# EAGLE design eib-32-intan-hs (EAGLE 8.3.2)
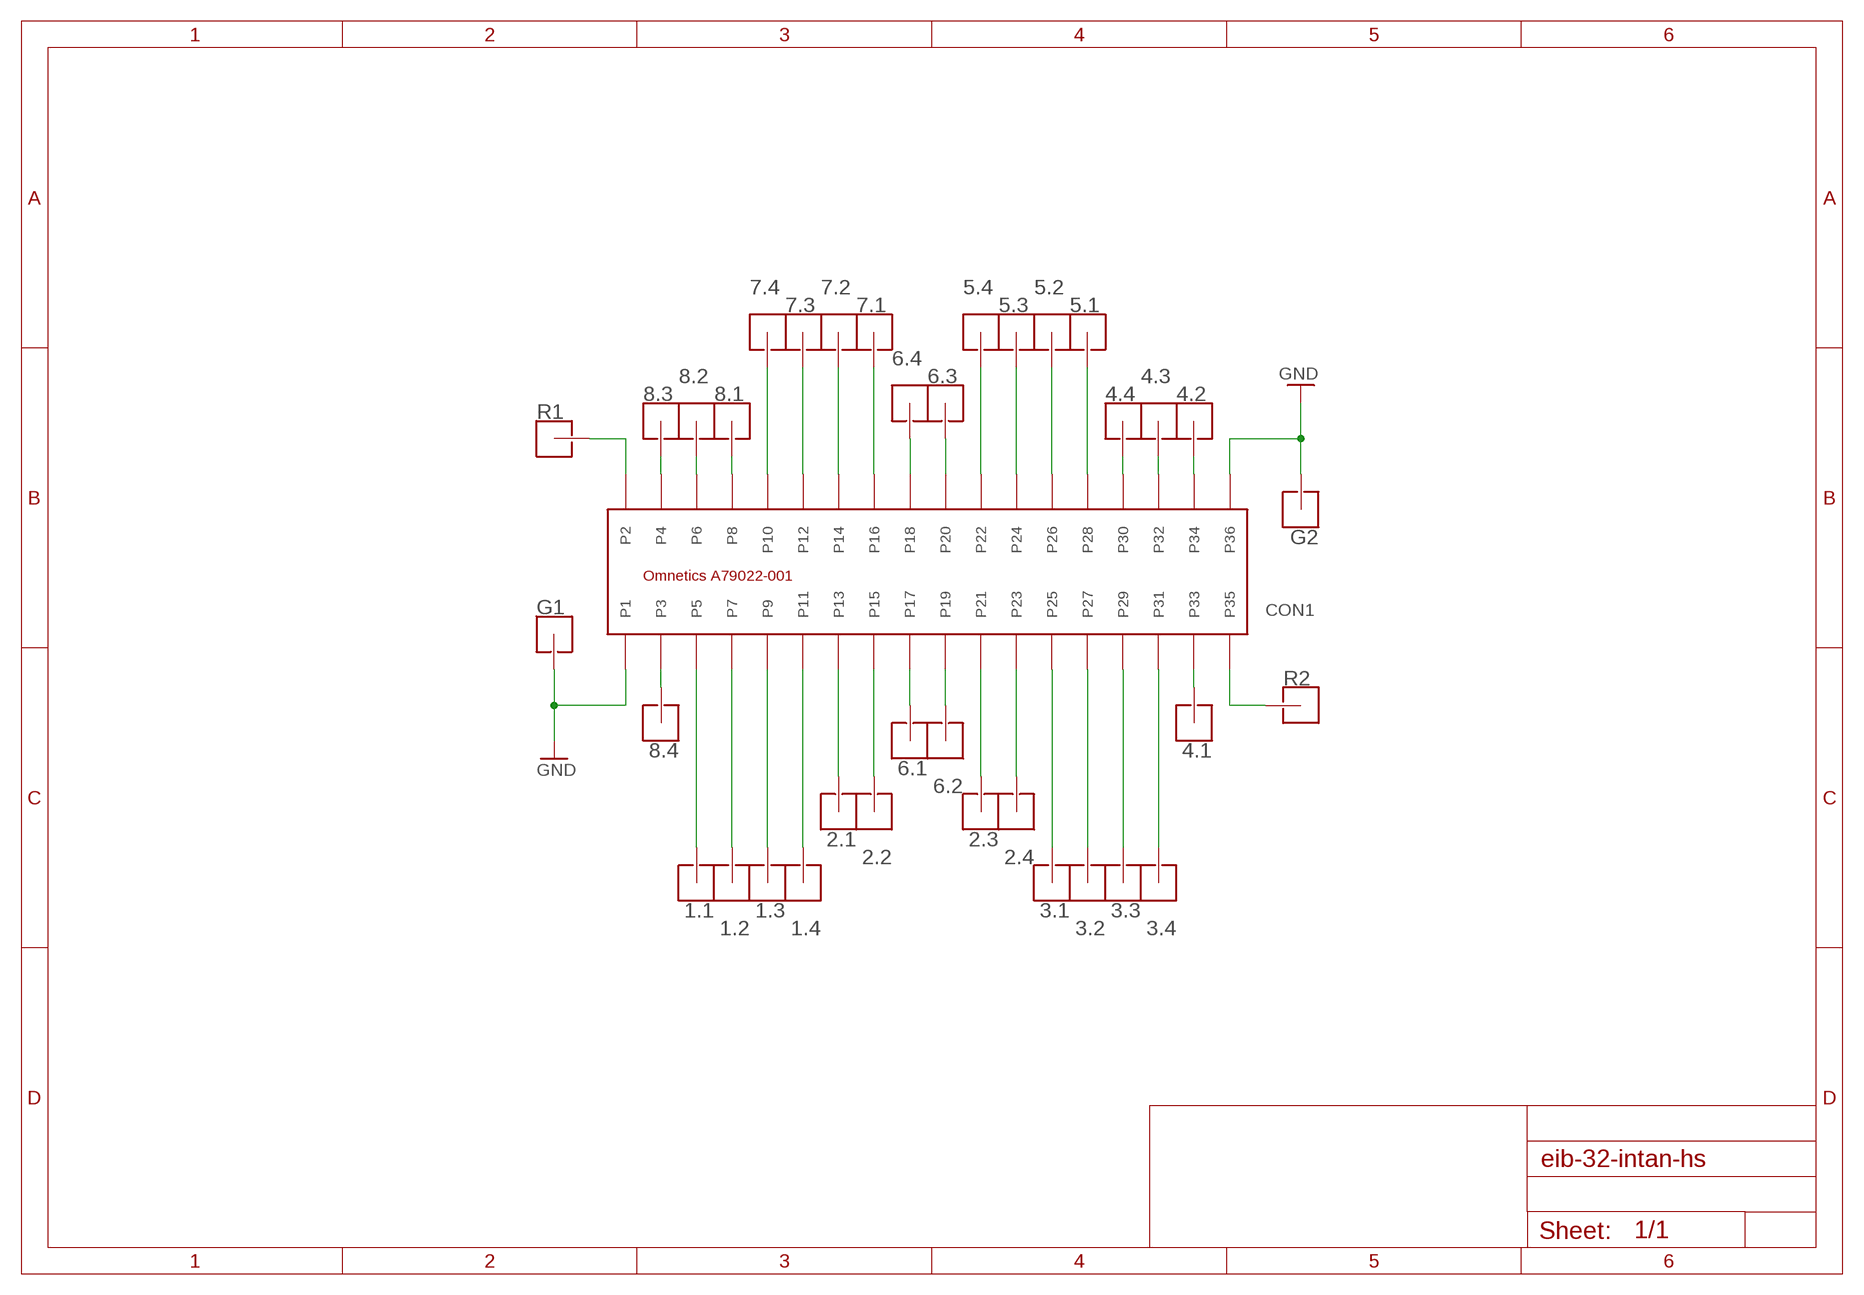
[diagram p0: schematic, sheet 1]

## Parts
1.1  HOLE_L_G_PIN_V7  [LARGE_GOLD_PIN_V7]
1.2  HOLE_L_G_PIN_V7  [LARGE_GOLD_PIN_V7]
1.3  HOLE_L_G_PIN_V7  [LARGE_GOLD_PIN_V7]
1.4  HOLE_L_G_PIN_V7  [LARGE_GOLD_PIN_V7]
2.1  HOLE_L_G_PIN_V7  [LARGE_GOLD_PIN_V7]
2.2  HOLE_L_G_PIN_V7  [LARGE_GOLD_PIN_V7]
2.3  HOLE_L_G_PIN_V7  [LARGE_GOLD_PIN_V7]
2.4  HOLE_L_G_PIN_V7  [LARGE_GOLD_PIN_V7]
3.1  HOLE_L_G_PIN_V7  [LARGE_GOLD_PIN_V7]
3.2  HOLE_L_G_PIN_V7  [LARGE_GOLD_PIN_V7]
3.3  HOLE_L_G_PIN_V7  [LARGE_GOLD_PIN_V7]
3.4  HOLE_L_G_PIN_V7  [LARGE_GOLD_PIN_V7]
4.1  HOLE_L_G_PIN_V7  [LARGE_GOLD_PIN_V7]
4.2  HOLE_L_G_PIN_V7  [LARGE_GOLD_PIN_V7]
4.3  HOLE_L_G_PIN_V7  [LARGE_GOLD_PIN_V7]
4.4  HOLE_L_G_PIN_V7  [LARGE_GOLD_PIN_V7]
5.1  HOLE_L_G_PIN_V7  [LARGE_GOLD_PIN_V7]
5.2  HOLE_L_G_PIN_V7  [LARGE_GOLD_PIN_V7]
5.3  HOLE_L_G_PIN_V7  [LARGE_GOLD_PIN_V7]
5.4  HOLE_L_G_PIN_V7  [LARGE_GOLD_PIN_V7]
6.1  HOLE_L_G_PIN_V7  [LARGE_GOLD_PIN_V7]
6.2  HOLE_L_G_PIN_V7  [LARGE_GOLD_PIN_V7]
6.3  HOLE_L_G_PIN_V7  [LARGE_GOLD_PIN_V7]
6.4  HOLE_L_G_PIN_V7  [LARGE_GOLD_PIN_V7]
7.1  HOLE_L_G_PIN_V7  [LARGE_GOLD_PIN_V7]
7.2  HOLE_L_G_PIN_V7  [LARGE_GOLD_PIN_V7]
7.3  HOLE_L_G_PIN_V7  [LARGE_GOLD_PIN_V7]
7.4  HOLE_L_G_PIN_V7  [LARGE_GOLD_PIN_V7]
8.1  HOLE_L_G_PIN_V7  [LARGE_GOLD_PIN_V7]
8.2  HOLE_L_G_PIN_V7  [LARGE_GOLD_PIN_V7]
8.3  HOLE_L_G_PIN_V7  [LARGE_GOLD_PIN_V7]
8.4  HOLE_L_G_PIN_V7  [LARGE_GOLD_PIN_V7]
CON1  A79022-001_MALESMD  [A79026-001_MALE]
G1  HOLE_L_G_PIN_V7  [LARGE_GOLD_PIN_V7]
G2  HOLE_L_G_PIN_V7  [LARGE_GOLD_PIN_V7]
R1  HOLE_L_G_PIN_V7  [LARGE_GOLD_PIN_V7]
R2  HOLE_L_G_PIN_V7  [LARGE_GOLD_PIN_V7]

## Nets
GND: CON1.P1 CON1.P36 G1.P$1 G2.P$1
N$1: 1.1.P$1 CON1.P5
N$2: 1.2.P$1 CON1.P7
N$3: 1.3.P$1 CON1.P9
N$4: 4.1.P$1 CON1.P33
N$5: 4.3.P$1 CON1.P32
N$6: 4.2.P$1 CON1.P34
N$7: 1.4.P$1 CON1.P11
N$8: 4.4.P$1 CON1.P30
N$9: 6.1.P$1 CON1.P17
N$10: 6.2.P$1 CON1.P19
N$11: 6.3.P$1 CON1.P20
N$12: 7.3.P$1 CON1.P12
N$13: 2.1.P$1 CON1.P13
N$14: 2.2.P$1 CON1.P15
N$15: 2.3.P$1 CON1.P21
N$16: 2.4.P$1 CON1.P23
N$17: 3.1.P$1 CON1.P25
N$18: 3.2.P$1 CON1.P27
N$19: 3.3.P$1 CON1.P29
N$20: 3.4.P$1 CON1.P31
N$21: 6.4.P$1 CON1.P18
N$22: 8.4.P$1 CON1.P3
N$23: 8.3.P$1 CON1.P4
N$24: 8.2.P$1 CON1.P6
N$25: 8.1.P$1 CON1.P8
N$26: 7.2.P$1 CON1.P14
N$27: 7.1.P$1 CON1.P16
N$28: 7.4.P$1 CON1.P10
N$29: 5.1.P$1 CON1.P28
N$30: 5.2.P$1 CON1.P26
N$31: 5.4.P$1 CON1.P22
N$32: 5.3.P$1 CON1.P24
N$34: CON1.P2 R1.P$1
N$35: CON1.P35 R2.P$1

## Library data of the parts
1.1-1.4 2.1-2.4 3.1-3.4 4.1-4.4 5.1-5.4 6.1-6.4 7.1-7.4 8.1-8.4 G1 G2 R1 R2 = holes:HOLE
CON1 = omnetics:A79022-001_MALE

## Board
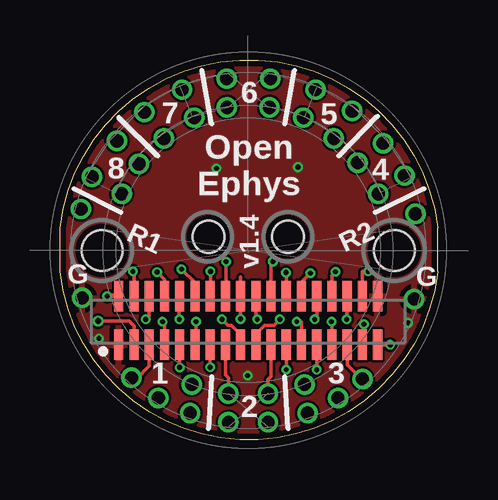
[diagram p1: board, top side]
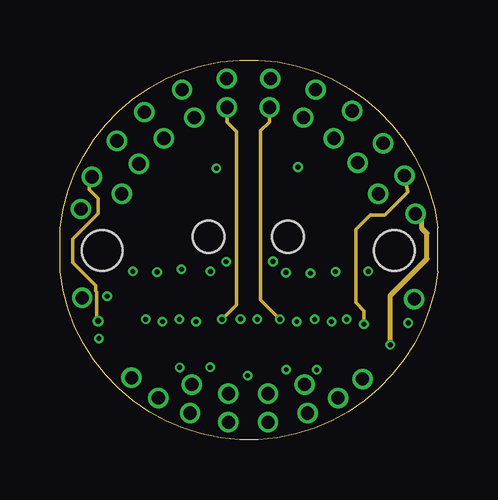
[diagram p2: board, inner layer Route2]
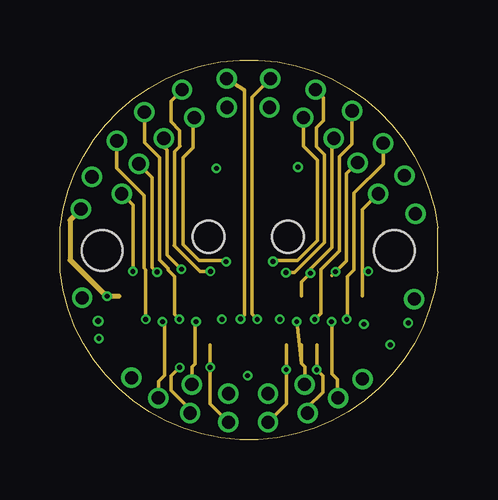
[diagram p3: board, inner layer Route3]
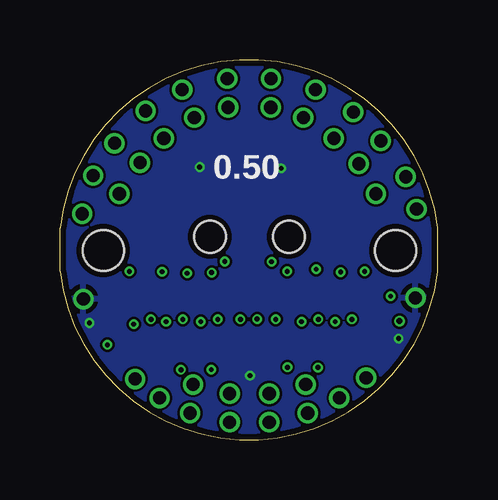
[diagram p4: board, bottom side, seen from below]

Size 15.76 x 15.84 mm. Coordinates in mm from the lower left corner, seen from the top.
Outline: 0,7.01 0,8.83 arc-167 15.76,8.83 15.76,7.01 arc-167 0,7.01
Copper layers (1+2*3+16): Top 0.012mm / dielectric 1.55mm / Route2 0.018mm / dielectric 0.71mm / Route3 0.018mm / dielectric 0.36mm / Bottom 0.012mm
Design rules "eC_2Layer_PClass8_BaseCopperO12 CHANGED *": minimum track width 0.1mm, minimum drill 0.2mm, track to track 0.1mm, track to pad 0.1mm, pad to pad 0.1mm, via to via 0.1mm, smd to smd 0mil, copper to edge 0.25mm, drill to drill 0.35mm, minimum pad ring 0.1mm, minimum via ring 0.1mm, stop-mask expansion 0mil, vias tented up to drill 0.45mm, thermal gap 0.2mm
Holes 1.32 mm at 6.2,8.47 9.5,8.47
Holes 1.7 mm at 1.76,7.89 13.95,7.89

### Footprints (pad centres in the part's own frame; a part is rotated, then mirrored left to right if it is on the bottom)
LARGE_GOLD_PIN_V7 = drill 0.55 pad 0.85: P$1 0,0
A79026-001_MALE = smd 0.381 x 1.27: P1 -5.397,-1.016; P2 -5.397,1.016; P3 -4.763,-1.016; P4 -4.763,1.016; P5 -4.128,-1.016; P6 -4.128,1.016; P7 -3.493,-1.016; P8 -3.493,1.016; P9 -2.857,-1.016; P10 -2.857,1.016; P11 -2.223,-1.016; P12 -2.223,1.016; P13 -1.587,-1.016; P14 -1.587,1.016; P15 -0.953,-1.016; P16 -0.953,1.016; P17 -0.318,-1.016; P18 -0.318,1.016; P19 0.318,-1.016; P20 0.318,1.016; P21 0.953,-1.016; P22 0.953,1.016; P23 1.587,-1.016; P24 1.587,1.016; P25 2.223,-1.016; P26 2.223,1.016; P27 2.857,-1.016; P28 2.857,1.016; P29 3.493,-1.016; P30 3.493,1.016; P31 4.128,-1.016; P32 4.128,1.016; P33 4.763,-1.016; P34 4.763,1.016; P35 5.397,-1.016; P36 5.397,1.016

### Placement (x,y rotation side)
1.1  2.99,2.58 0 top
1.2  4.11,1.74 0 top
1.3  5.43,1.11 0 top
1.4  5.5,2.31 0 top
2.1  7.03,0.73 0 top
2.2  7.03,1.93 0 top
2.3  8.68,1.93 0 top
2.4  8.68,0.73 0 top
3.1  10.2,2.31 90 top
3.2  10.33,1.11 90 top
3.3  11.6,1.74 90 top
3.4  12.62,2.53 90 top
4.1  14.37,11.02 270 top
4.2  13.28,10.26 0 top
4.3  13.48,12.37 270 top
4.4  12.41,11.55 0 top
5.1  12.18,13.71 90 top
5.2  11.42,12.57 90 top
5.3  10.66,14.6 90 top
5.4  10.15,13.43 90 top
6.1  6.96,13.86 270 top
6.2  8.74,13.86 0 top
6.3  8.78,15.06 270 top
6.4  6.95,15.06 0 top
7.1  5.6,13.43 270 top
7.2  5.09,14.6 0 top
7.3  4.33,12.57 0 top
7.4  3.52,13.66 0 top
8.1  3.29,11.5 0 top
8.2  2.37,12.47 0 top
8.3  2.58,10.26 0 top
8.4  1.33,10.97 0 top
CON1  7.85,4.97 0 top
G1  0.93,5.92 0 top
G2  14.78,5.87 0 top
R1  0.88,9.62 0 top
R2  14.83,9.42 0 top

### Tracks (layer width: path | path; a pad name or v marks a point on that pad's centre or on a via)
GND  (via drill 0.2)
  other vias: 7.83,2.67 1.63,4.22 14.53,4.87 9.93,11.37 6.53,11.32
  pour Top: -2.82,21.22 19.18,21.22 19.18,-4.78 -2.82,-4.78
  pour Bottom: -1.82,20.22 20.18,20.22 20.18,-5.78 -1.82,-5.78
N$1
  Top 0.152: CON1.P5 3.72,3.07 3.24,2.58 1.1.P$1
N$2  (via drill 0.2)
  Top 0.152: CON1.P7 4.36,4.84 v4.28,4.92
  Route3 0.152: 1.2.P$1 4.11,2.43 4.36,2.69 4.36,4.92 v4.28,4.92
N$3  (via drill 0.2)
  Top 0.152: CON1.P9 v5,3.02
  Route3 0.152: 1.3.P$1 5.43,1.27 4.64,2.05 4.64,2.66 v5,3.02
N$4  (via drill 0.2)
  Top 0.152: CON1.P33 12.68,4.02 v12.68,4.82
  Route2 0.152: 4.1.P$1 14.52,10.33 13.56,9.37 12.95,9.37 12.34,8.76 12.34,5.72 12.68,5.38 v12.68,4.82
N$5  (via drill 0.2)
  Top 0.152: CON1.P32 11.96,5.97 v11.96,5.02
  Route3 0.152: 11.98,6.72 CON1.P32 | 11.98,6.72 11.98,6.8 12.26,7.08 12.26,10.28 13.48,11.5 4.3.P$1 | v11.96,5.02 11.98,5.04 11.98,6.72
N$6  (via drill 0.2)
  Top 0.152: CON1.P34 12.62,7.02 v12.86,7.02
  Route3 0.152: 4.2.P$1 12.62,9.6 12.62,7.72 12.62,7.02 | 12.62,7.02 CON1.P34 | v12.86,7.02 12.62,7.02
N$7  (via drill 0.2)
  Top 0.152: CON1.P11 5.68,3.96 v5.68,4.92
  Route3 0.152: 1.4.P$1 5.5,3.03 5.63,3.16 5.63,4.92 v5.68,4.92
N$8  (via drill 0.2)
  Top 0.152: v11.5,7 11.35,6.85 CON1.P30
  Route3 0.152: 11.35,6.85 v11.5,7 11.95,7.46 11.95,11.09 4.4.P$1
N$9  (via drill 0.2)
  Top 0.152: v6.76,5.02 7.01,4.77 7.16,4.77 7.53,4.4 CON1.P17
  Route2 0.152: 6.1.P$1 6.96,13.25 7.36,12.86 7.36,5.62 v6.76,5.02
N$10  (via drill 0.2)
  Top 0.152: v9.17,5.02 8.92,4.77 8.54,4.77 8.17,4.4 CON1.P19
  Route2 0.152: 6.2.P$1 8.74,13.25 8.37,12.89 8.37,5.82 v9.17,5.02
N$11  (via drill 0.2)
  Top 0.152: CON1.P20 8.17,5.08 v8.23,5.02
  Route3 0.152: 6.3.P$1 8.01,14.29 8.01,5.24 v8.23,5.02
N$12  (via drill 0.2)
  Top 0.152: CON1.P12 5.63,6.55 v5.07,7.11
  Route3 0.152: v5.07,7.11 4.47,7.71 4.47,12.07 4.33,12.21 7.3.P$1
N$13  (via drill 0.2)
  Top 0.152: CON1.P13 v6.26,3.02
  Route3 0.152: CON1.P13 v6.26,3.02 6.26,1.49 2.1.P$1
N$14
  Top 0.152: CON1.P15 6.9,2.7 7.03,2.57 2.2.P$1
  Route3 0.152: 2.2.P$1
N$15
  Top 0.152: CON1.P21 8.81,2.65 8.68,2.52 2.3.P$1
N$16  (via drill 0.2)
  Top 0.152: CON1.P23 v9.44,2.92
  Route3 0.152: CON1.P23 v9.44,2.92 9.44,1.49 2.4.P$1
N$17  (via drill 0.2)
  Top 0.152: CON1.P25 10.08,4.92 v9.88,4.92
  Route3 0.152: 10.08,3.18 CON1.P25 | 10.08,3.18 10.23,3.03 10.23,2.33 3.1.P$1 | v9.88,4.92 10.08,3.19 10.08,3.18
N$18  (via drill 0.2)
  Top 0.152: CON1.P27 v10.71,2.92
  Route3 0.152: CON1.P27 v10.71,2.92 10.97,2.66 10.97,1.98 10.33,1.34 3.2.P$1
N$19  (via drill 0.2)
  Top 0.152: CON1.P29 11.35,4.85 v11.33,4.92
  Route3 0.152: v11.33,4.92 11.35,4.85 11.35,2.74 11.57,2.51 11.57,1.77 3.3.P$1
N$20
  Top 0.152: CON1.P31 11.98,3.12 12.03,3.07 12.57,2.53 3.4.P$1
N$21  (via drill 0.2)
  Top 0.152: CON1.P18 7.53,6.78 v7.53,5.03
  Route3 0.152: 6.4.P$1 7.7,14.59 7.7,5.2 v7.53,5.03
N$22  (via drill 0.25)
  Top 0.152: CON1.P3 3.09,4.75 2.89,4.95 v1.59,4.95
  Route2 0.152: 8.4.P$1 1.21,11.04 1.21,10.43 1.59,10.05 1.59,9.44 0.52,8.38 0.52,7.39 1.48,6.43 1.48,6.21 1.53,6.17 1.53,5.01 v1.59,4.95
N$23  (via drill 0.2)
  Top 0.152: CON1.P4 3.09,6.97 v3.04,7.02
  Route3 0.152: 8.3.P$1 3.04,9.79 v3.04,7.02
N$24  (via drill 0.2)
  Top 0.152: CON1.P6 3.72,5.17 v3.58,5.02
  Route3 0.152: v3.58,5.02 3.58,7.09 3.51,7.15 3.51,10.19 2.37,11.33 8.2.P$1
N$25  (via drill 0.2)
  Top 0.152: CON1.P8 4.36,6.69 v4.05,6.99
  Route3 0.152: 8.1.P$1 3.85,10.94 3.85,7.19 v4.05,6.99
N$26  (via drill 0.2)
  Top 0.152: 6.28,5.98 CON1.P14 6.28,6 v6.28,7.02
  Route3 0.152: v6.28,7.02 5.84,7.02 4.76,8.1 4.78,8.12 4.78,12.02 5,12.25 4.99,12.25 4.99,12.9 4.63,13.26 4.63,14.12 5.09,14.58 7.2.P$1
N$27  (via drill 0.2)
  Top 0.152: CON1.P16 6.93,6.02 v6.93,7.42
  Route3 0.152: 7.1.P$1 5.55,13.38 5.55,12.19 5.13,11.77 5.13,8.14 5.79,7.48 6.87,7.48 v6.93,7.42
N$28  (via drill 0.2)
  Top 0.152: CON1.P10 4.98,5.97 v4.98,5.02
  Route3 0.152: v4.98,5.02 4.78,5.22 4.78,6.8 4.5,7.07 4.5,7.15 4.15,7.5 4.15,11.76 3.52,12.39 7.4.P$1
N$29  (via drill 0.2)
  Top 0.152: CON1.P28 10.71,5.02 v10.63,5.02
  Route3 0.152: 5.1.P$1 12.18,12.34 11.65,11.81 11.65,7.87 10.88,7.1 10.88,5.27 v10.63,5.02
N$30  (via drill 0.2)
  Top 0.152: CON1.P26 10.08,6.57 v10.45,6.95
  Route3 0.152: CON1.P26 10.08,6.57 v10.45,6.95 10.45,7.12 11.35,8.02 11.35,12.17 11.42,12.25 5.2.P$1
N$31  (via drill 0.2)
  Top 0.152: CON1.P22 8.81,7.35 v8.89,7.43
  Route3 0.152: 5.4.P$1 10.15,12.24 10.74,11.65 10.74,8.3 9.91,7.48 8.93,7.48 v8.89,7.43
N$32  (via drill 0.2)
  Top 0.152: CON1.P24 9.44,6.96 v9.43,6.97
  Route3 0.152: 5.3.P$1 10.99,14.28 10.99,13.3 10.7,13.02 10.7,12.22 11.04,11.88 11.04,8.23 9.79,6.97 v9.43,6.97
N$34  (via drill 0.2)
  Top 0.203: CON1.P2 v1.97,5.99
  Route3 0.203: CON1.P2 v1.97,5.99 1.92,5.99 0.42,7.49 0.42,9.15 0.43,9.17 R1.P$1
N$35  (via drill 0.2)
  Top 0.152: CON1.P35 v13.78,3.96
  Route2 0.203: R2.P$1 15.1,9.6 15.1,8.81 15.31,8.61 15.31,7.54 13.78,6.01 v13.78,3.96

### Text on the board
tPlace: 6 | 7 | 5 | 8 | 4 | Open / Ephys | R1 | R2 | v1.4 | G | G | 1 | 3 | 2
bPlace: 0.50